# EAGLE schematic FLD Logic 2 (EAGLE 6.5.0)
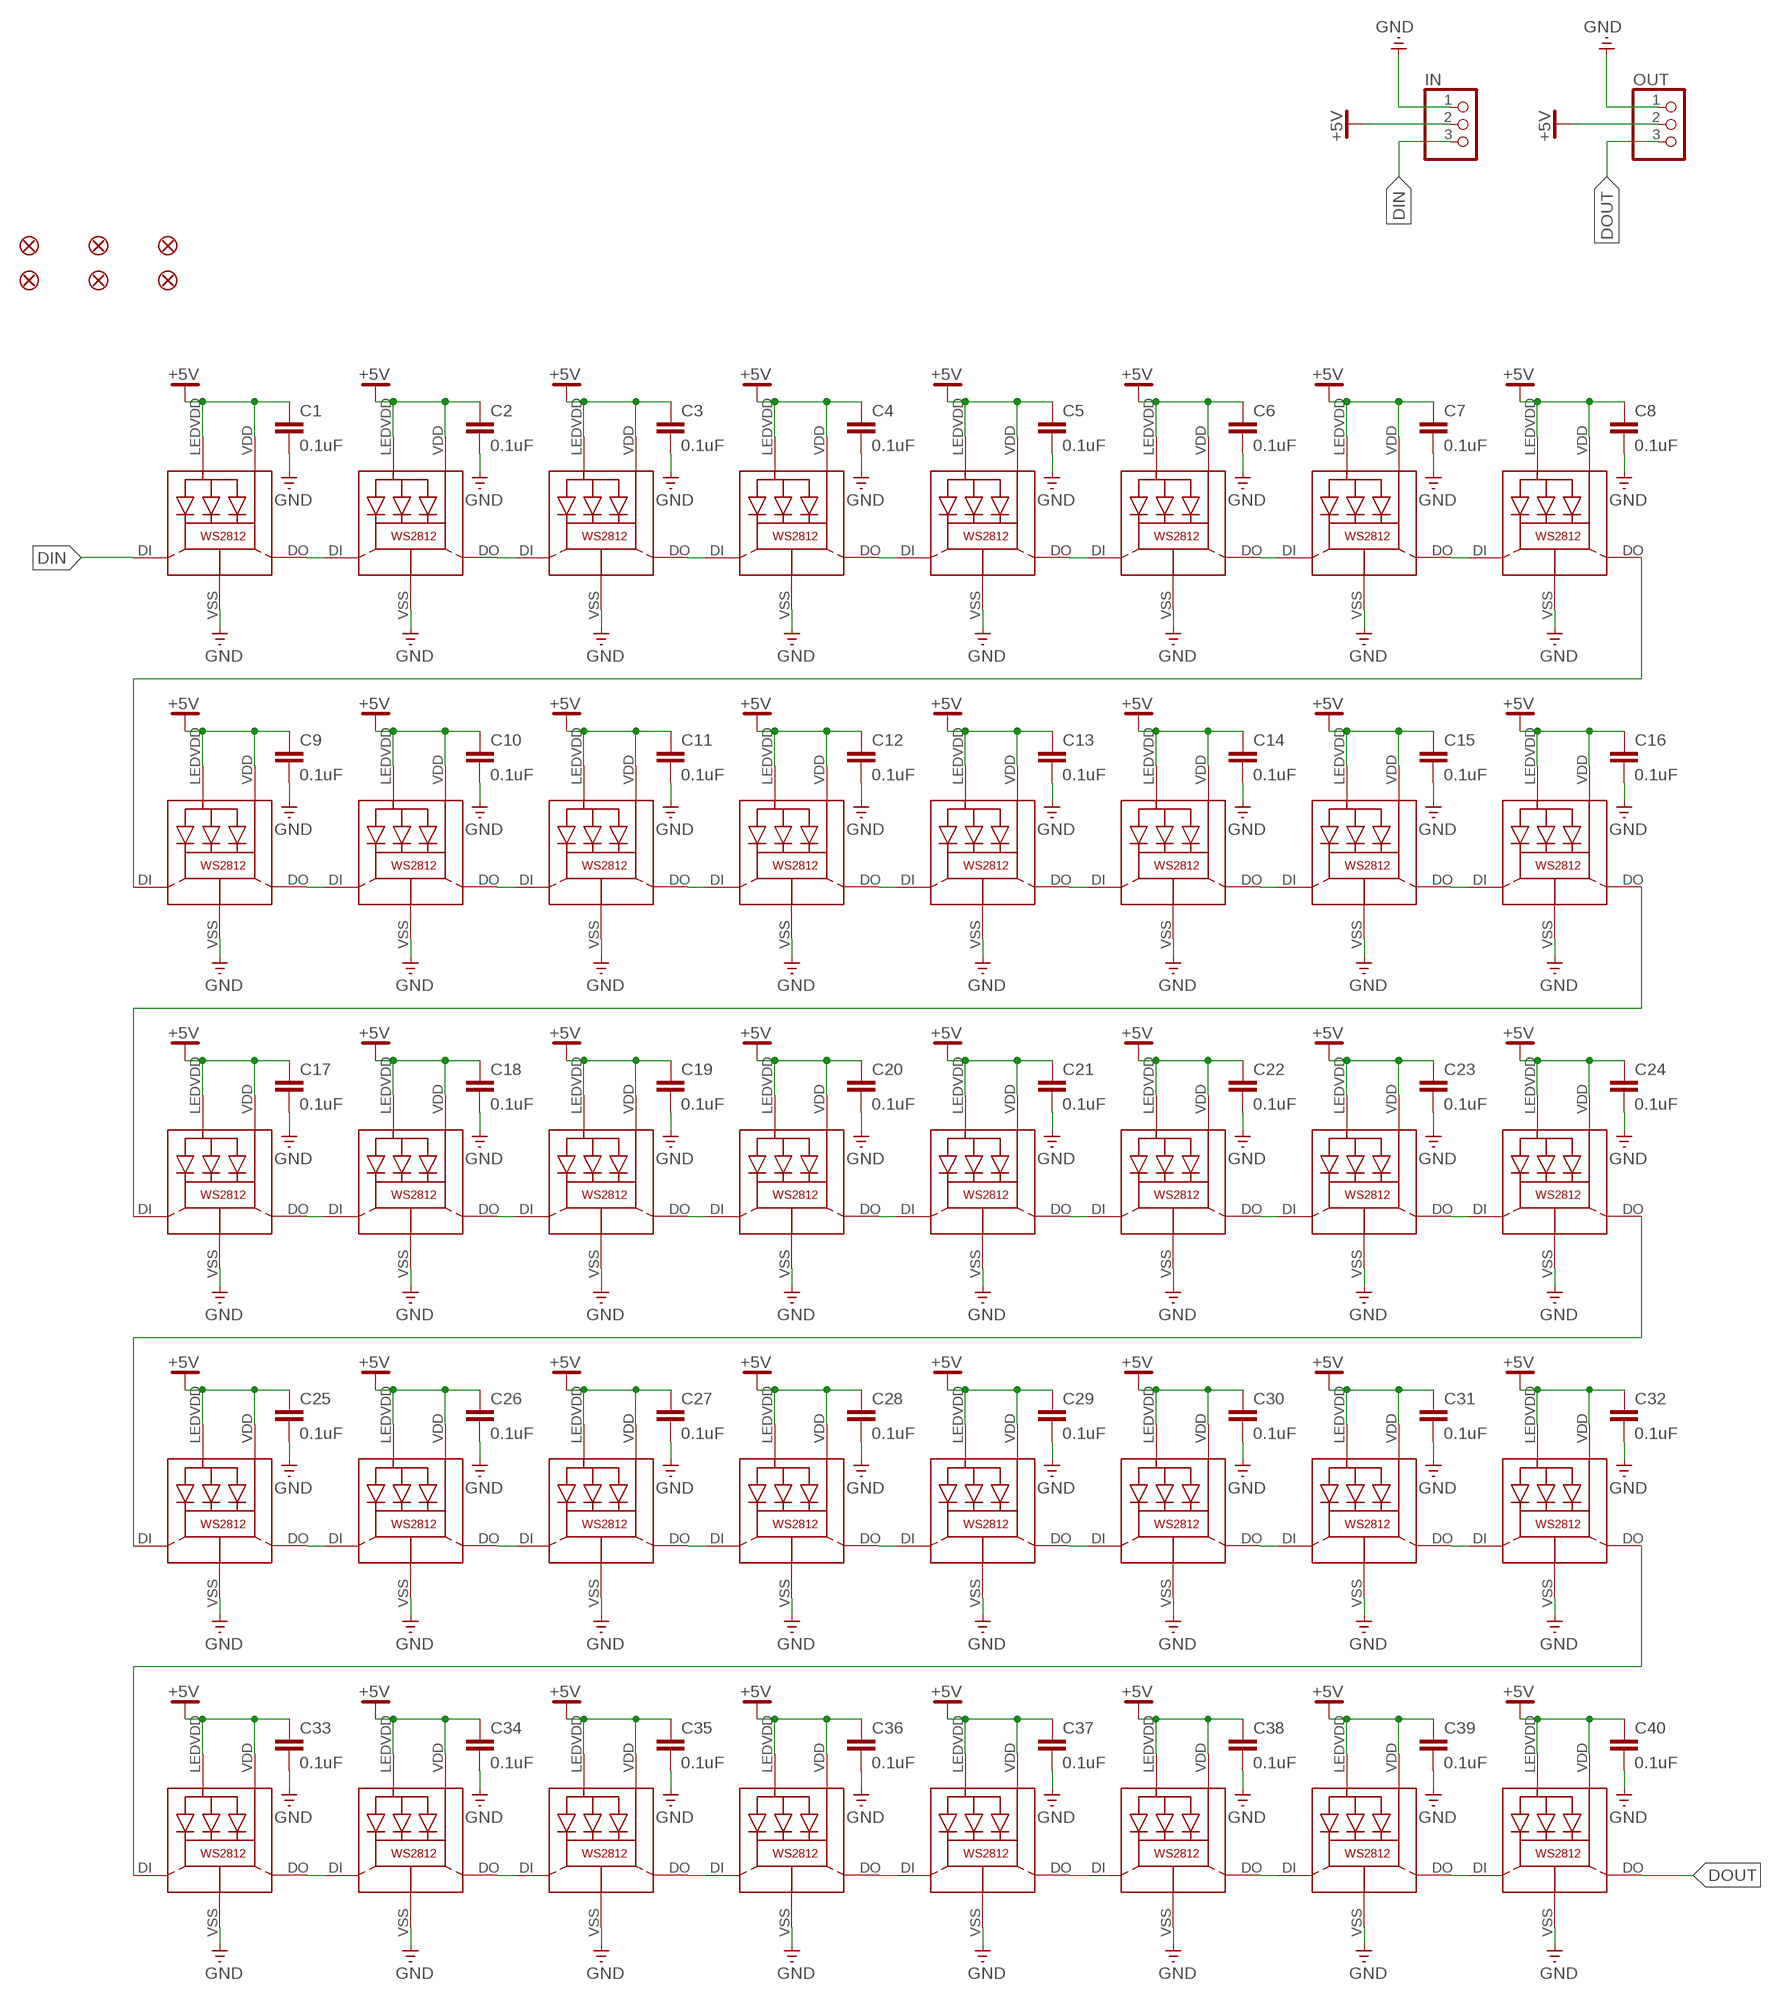
[diagram p0: schematic, sheet 1]

## Parts
C1  0.1uF  CAP0805  [0805]
C2  0.1uF  CAP0805  [0805]
C3  0.1uF  CAP0805  [0805]
C4  0.1uF  CAP0805  [0805]
C5  0.1uF  CAP0805  [0805]
C6  0.1uF  CAP0805  [0805]
C7  0.1uF  CAP0805  [0805]
C8  0.1uF  CAP0805  [0805]
C9  0.1uF  CAP0805  [0805]
C10  0.1uF  CAP0805  [0805]
C11  0.1uF  CAP0805  [0805]
C12  0.1uF  CAP0805  [0805]
C13  0.1uF  CAP0805  [0805]
C14  0.1uF  CAP0805  [0805]
C15  0.1uF  CAP0805  [0805]
C16  0.1uF  CAP0805  [0805]
C17  0.1uF  CAP0805  [0805]
C18  0.1uF  CAP0805  [0805]
C19  0.1uF  CAP0805  [0805]
C20  0.1uF  CAP0805  [0805]
C21  0.1uF  CAP0805  [0805]
C22  0.1uF  CAP0805  [0805]
C23  0.1uF  CAP0805  [0805]
C24  0.1uF  CAP0805  [0805]
C25  0.1uF  CAP0805  [0805]
C26  0.1uF  CAP0805  [0805]
C27  0.1uF  CAP0805  [0805]
C28  0.1uF  CAP0805  [0805]
C29  0.1uF  CAP0805  [0805]
C30  0.1uF  CAP0805  [0805]
C31  0.1uF  CAP0805  [0805]
C32  0.1uF  CAP0805  [0805]
C33  0.1uF  CAP0805  [0805]
C34  0.1uF  CAP0805  [0805]
C35  0.1uF  CAP0805  [0805]
C36  0.1uF  CAP0805  [0805]
C37  0.1uF  CAP0805  [0805]
C38  0.1uF  CAP0805  [0805]
C39  0.1uF  CAP0805  [0805]
C40  0.1uF  CAP0805  [0805]
FID1  FIDUCIAL1.5X3  [FIDUCIAL-1.5X3]
FID2  FIDUCIAL1.5X3  [FIDUCIAL-1.5X3]
FID3  FIDUCIAL1.5X3  [FIDUCIAL-1.5X3]
FID4  FIDUCIAL1.5X3  [FIDUCIAL-1.5X3]
FID5  FIDUCIAL1.5X3  [FIDUCIAL-1.5X3]
FID6  FIDUCIAL1.5X3  [FIDUCIAL-1.5X3]
IN  PINHD-1X3  [1X03]
LED1  WS2812  [WS2812]
LED2  WS2812  [WS2812]
LED3  WS2812  [WS2812]
LED4  WS2812  [WS2812]
LED5  WS2812  [WS2812]
LED6  WS2812  [WS2812]
LED7  WS2812  [WS2812]
LED8  WS2812  [WS2812]
LED9  WS2812  [WS2812]
LED10  WS2812  [WS2812]
LED11  WS2812  [WS2812]
LED12  WS2812  [WS2812]
LED13  WS2812  [WS2812]
LED14  WS2812  [WS2812]
LED15  WS2812  [WS2812]
LED16  WS2812  [WS2812]
LED17  WS2812  [WS2812]
LED18  WS2812  [WS2812]
LED19  WS2812  [WS2812]
LED20  WS2812  [WS2812]
LED21  WS2812  [WS2812]
LED22  WS2812  [WS2812]
LED23  WS2812  [WS2812]
LED24  WS2812  [WS2812]
LED25  WS2812  [WS2812]
LED26  WS2812  [WS2812]
LED27  WS2812  [WS2812]
LED28  WS2812  [WS2812]
LED29  WS2812  [WS2812]
LED30  WS2812  [WS2812]
LED31  WS2812  [WS2812]
LED32  WS2812  [WS2812]
LED33  WS2812  [WS2812]
LED34  WS2812  [WS2812]
LED35  WS2812  [WS2812]
LED36  WS2812  [WS2812]
LED37  WS2812  [WS2812]
LED38  WS2812  [WS2812]
LED39  WS2812  [WS2812]
LED40  WS2812  [WS2812]
OUT  PINHD-1X3  [1X03]

## Nets
+5V [supply]: C1.1 C2.1 C3.1 C4.1 C5.1 C6.1 C7.1 C8.1 C9.1 C10.1 C11.1 C12.1 C13.1 C14.1 C15.1 C16.1 C17.1 C18.1 C19.1 C20.1 C21.1 C22.1 C23.1 C24.1 C25.1 C26.1 C27.1 C28.1 C29.1 C30.1 C31.1 C32.1 C33.1 C34.1 C35.1 C36.1 C37.1 C38.1 C39.1 C40.1 IN.2 LED1.LEDVDD LED1.VDD LED2.LEDVDD LED2.VDD LED3.LEDVDD LED3.VDD LED4.LEDVDD LED4.VDD LED5.LEDVDD LED5.VDD LED6.LEDVDD LED6.VDD LED7.LEDVDD LED7.VDD LED8.LEDVDD LED8.VDD LED9.LEDVDD LED9.VDD LED10.LEDVDD LED10.VDD LED11.LEDVDD LED11.VDD LED12.LEDVDD LED12.VDD LED13.LEDVDD LED13.VDD LED14.LEDVDD LED14.VDD LED15.LEDVDD LED15.VDD LED16.LEDVDD LED16.VDD LED17.LEDVDD LED17.VDD LED18.LEDVDD LED18.VDD LED19.LEDVDD LED19.VDD LED20.LEDVDD LED20.VDD LED21.LEDVDD LED21.VDD LED22.LEDVDD LED22.VDD LED23.LEDVDD LED23.VDD LED24.LEDVDD LED24.VDD LED25.LEDVDD LED25.VDD LED26.LEDVDD LED26.VDD LED27.LEDVDD LED27.VDD LED28.LEDVDD LED28.VDD LED29.LEDVDD LED29.VDD LED30.LEDVDD LED30.VDD LED31.LEDVDD LED31.VDD LED32.LEDVDD LED32.VDD LED33.LEDVDD LED33.VDD LED34.LEDVDD LED34.VDD LED35.LEDVDD LED35.VDD LED36.LEDVDD LED36.VDD LED37.LEDVDD LED37.VDD LED38.LEDVDD LED38.VDD LED39.LEDVDD LED39.VDD LED40.LEDVDD LED40.VDD OUT.2
DIN: IN.3 LED1.DI
DOUT: LED40.DO OUT.3
GND [supply]: C1.2 C2.2 C3.2 C4.2 C5.2 C6.2 C7.2 C8.2 C9.2 C10.2 C11.2 C12.2 C13.2 C14.2 C15.2 C16.2 C17.2 C18.2 C19.2 C20.2 C21.2 C22.2 C23.2 C24.2 C25.2 C26.2 C27.2 C28.2 C29.2 C30.2 C31.2 C32.2 C33.2 C34.2 C35.2 C36.2 C37.2 C38.2 C39.2 C40.2 IN.1 LED1.VSS(GND) LED2.VSS(GND) LED3.VSS(GND) LED4.VSS(GND) LED5.VSS(GND) LED6.VSS(GND) LED7.VSS(GND) LED8.VSS(GND) LED9.VSS(GND) LED10.VSS(GND) LED11.VSS(GND) LED12.VSS(GND) LED13.VSS(GND) LED14.VSS(GND) LED15.VSS(GND) LED16.VSS(GND) LED17.VSS(GND) LED18.VSS(GND) LED19.VSS(GND) LED20.VSS(GND) LED21.VSS(GND) LED22.VSS(GND) LED23.VSS(GND) LED24.VSS(GND) LED25.VSS(GND) LED26.VSS(GND) LED27.VSS(GND) LED28.VSS(GND) LED29.VSS(GND) LED30.VSS(GND) LED31.VSS(GND) LED32.VSS(GND) LED33.VSS(GND) LED34.VSS(GND) LED35.VSS(GND) LED36.VSS(GND) LED37.VSS(GND) LED38.VSS(GND) LED39.VSS(GND) LED40.VSS(GND) OUT.1
N$1: LED1.DO LED2.DI
N$2: LED3.DO LED4.DI
N$3: LED2.DO LED3.DI
N$4: LED5.DO LED6.DI
N$5: LED7.DO LED8.DI
N$6: LED6.DO LED7.DI
N$7: LED4.DO LED5.DI
N$8: LED9.DO LED10.DI
N$9: LED11.DO LED12.DI
N$10: LED10.DO LED11.DI
N$11: LED13.DO LED14.DI
N$12: LED15.DO LED16.DI
N$13: LED14.DO LED15.DI
N$14: LED12.DO LED13.DI
N$15: LED17.DO LED18.DI
N$16: LED19.DO LED20.DI
N$17: LED18.DO LED19.DI
N$18: LED21.DO LED22.DI
N$19: LED23.DO LED24.DI
N$20: LED22.DO LED23.DI
N$21: LED20.DO LED21.DI
N$22: LED25.DO LED26.DI
N$23: LED27.DO LED28.DI
N$24: LED26.DO LED27.DI
N$25: LED29.DO LED30.DI
N$26: LED31.DO LED32.DI
N$27: LED30.DO LED31.DI
N$28: LED28.DO LED29.DI
N$29: LED8.DO LED9.DI
N$30: LED16.DO LED17.DI
N$31: LED24.DO LED25.DI
N$32: LED33.DO LED34.DI
N$33: LED35.DO LED36.DI
N$34: LED34.DO LED35.DI
N$35: LED37.DO LED38.DI
N$36: LED39.DO LED40.DI
N$37: LED38.DO LED39.DI
N$38: LED36.DO LED37.DI
N$39: LED32.DO LED33.DI

## Library data of the parts
C1-C40 = SparkFun-Capacitors:CAP: Capacitor Standard 0603 ceramic capacitor, and 0.1" leaded capacitor.
FID1-FID6 = SparkFun-Aesthetics:FIDUCIAL: Fiducial Alignment Points Various fiducial points for machine vision alignment.
IN OUT = adafruit:PINHD-1X3: PIN HEADER
LED1-LED40 = rseries:WS2812

## Net classes
1 supply: width 0.406 mm, drill 0.33 mm, clearance 0.203 mm